# EAGLE design Raspberry_PI_Servo_Hat_v1 (EAGLE 7.5.0)
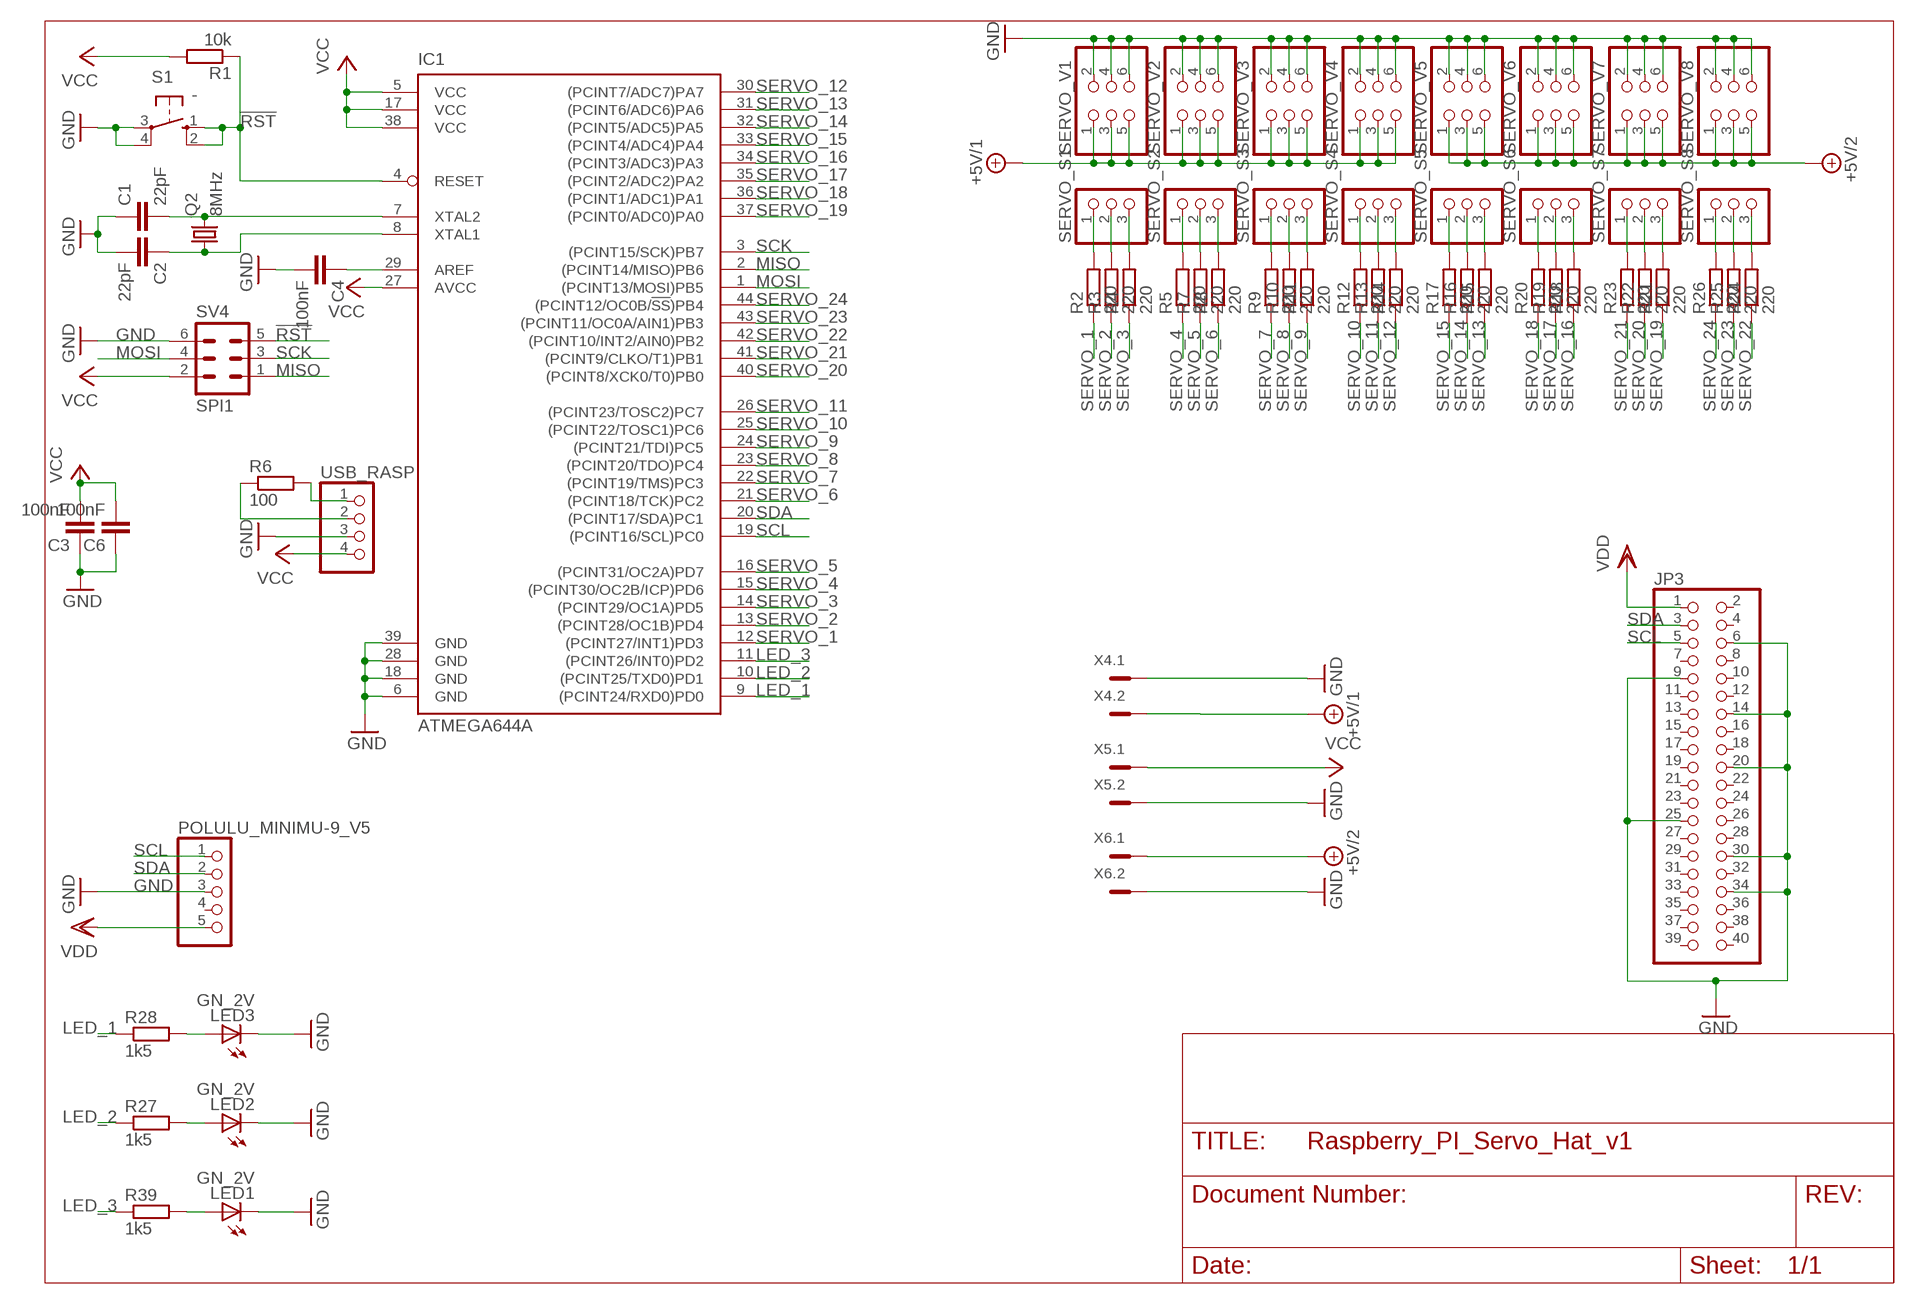
[diagram p0: schematic, sheet 1]

## Parts
C1  22pF  C-EUC0805  [C0805]
C2  22pF  C-EUC0805  [C0805]
C3  100nF  C-EUC0805  [C0805]
C4  100nF  C-EUC0805  [C0805]
C6  100nF  C-EUC0805  [C0805]
IC1  ATMEGA644A  [TQFP44]
JP3  PINHD-2X20  [2X20]
LED1  GN_2V  LED3MM  [LED3MM]
LED2  GN_2V  LED3MM  [LED3MM]
LED3  GN_2V  LED3MM  [LED3MM]
POLULU_MINIMU-9_V5  PINHD-1X5  [1X05]
Q2  8MHz  CRYSTALHC49U-V  [HC49U-V]
R1  10k  R-EU_R0805  [R0805]
R2  220  R-EU_R0805  [R0805]
R3  220  R-EU_R0805  [R0805]
R4  220  R-EU_R0805  [R0805]
R5  220  R-EU_R0805  [R0805]
R6  100  R-EU_R0805  [R0805]
R7  220  R-EU_R0805  [R0805]
R8  220  R-EU_R0805  [R0805]
R9  220  R-EU_R0805  [R0805]
R10  220  R-EU_R0805  [R0805]
R11  220  R-EU_R0805  [R0805]
R12  220  R-EU_R0805  [R0805]
R13  220  R-EU_R0805  [R0805]
R14  220  R-EU_R0805  [R0805]
R15  220  R-EU_R0805  [R0805]
R16  220  R-EU_R0805  [R0805]
R17  220  R-EU_R0805  [R0805]
R18  220  R-EU_R0805  [R0805]
R19  220  R-EU_R0805  [R0805]
R20  220  R-EU_R0805  [R0805]
R21  220  R-EU_R0805  [R0805]
R22  220  R-EU_R0805  [R0805]
R23  220  R-EU_R0805  [R0805]
R24  220  R-EU_R0805  [R0805]
R25  220  R-EU_R0805  [R0805]
R26  220  R-EU_R0805  [R0805]
R27  1k5  R-EU_R0805  [R0805]
R28  1k5  R-EU_R0805  [R0805]
R39  1k5  R-EU_R0805  [R0805]
S1  -  10-XX  [B3F-10XX]
SERVO_S1  PINHD-1X3  [1X03]
SERVO_S2  PINHD-1X3  [1X03]
SERVO_S3  PINHD-1X3  [1X03]
SERVO_S4  PINHD-1X3  [1X03]
SERVO_S5  PINHD-1X3  [1X03]
SERVO_S6  PINHD-1X3  [1X03]
SERVO_S7  PINHD-1X3  [1X03]
SERVO_S8  PINHD-1X3  [1X03]
SERVO_V1  PINHD-2X3  [2X03]
SERVO_V2  PINHD-2X3  [2X03]
SERVO_V3  PINHD-2X3  [2X03]
SERVO_V4  PINHD-2X3  [2X03]
SERVO_V5  PINHD-2X3  [2X03]
SERVO_V6  PINHD-2X3  [2X03]
SERVO_V7  PINHD-2X3  [2X03]
SERVO_V8  PINHD-2X3  [2X03]
SV4  SPI1  ML6  [ML6]
USB_RASP  PINHD-1X4  [1X04]
X4  MCV2  [MCV2]
X5  MCV2  [MCV2]
X6  MCV2  [MCV2]

## Nets
!RST: IC1.4(RESET) R1.1 S1.1(S) S1.2(S1) SV4.5
+5V/1: SERVO_V1.1 SERVO_V1.3 SERVO_V1.5 SERVO_V2.1 SERVO_V2.3 SERVO_V2.5 SERVO_V3.1 SERVO_V3.3 SERVO_V3.5 SERVO_V4.1 SERVO_V4.3 SERVO_V4.5 X4.2
+5V/2: SERVO_V5.1 SERVO_V5.3 SERVO_V5.5 SERVO_V6.1 SERVO_V6.3 SERVO_V6.5 SERVO_V7.1 SERVO_V7.3 SERVO_V7.5 SERVO_V8.1 SERVO_V8.3 SERVO_V8.5 X6.1
GND: C1.1 C2.2 C3.1 C4.2 C6.1 IC1.6(GND) IC1.18(GND) IC1.28(GND) IC1.39(GND) JP3.6 JP3.9 JP3.14 JP3.20 JP3.25 JP3.30 JP3.34 LED1.K(C) LED2.K(C) LED3.K(C) POLULU_MINIMU-9_V5.3 S1.3(P) S1.4(P1) SERVO_V1.2 SERVO_V1.4 SERVO_V1.6 SERVO_V2.2 SERVO_V2.4 SERVO_V2.6 SERVO_V3.2 SERVO_V3.4 SERVO_V3.6 SERVO_V4.2 SERVO_V4.4 SERVO_V4.6 SERVO_V5.2 SERVO_V5.4 SERVO_V5.6 SERVO_V6.2 SERVO_V6.4 SERVO_V6.6 SERVO_V7.2 SERVO_V7.4 SERVO_V7.6 SERVO_V8.2 SERVO_V8.4 SERVO_V8.6 SV4.6 USB_RASP.3 X4.1 X5.2 X6.2
LED_1: IC1.9((PCINT24/RXD0)PD0) R28.1
LED_2: IC1.10((PCINT25/TXD0)PD1) R27.1
LED_3: IC1.11((PCINT26/INT0)PD2) R39.1
MISO: IC1.2((PCINT14/MISO)PB6) SV4.1
MOSI: IC1.1((PCINT13/MOSI)PB5) SV4.4
N$1: C2.1 IC1.8(XTAL1) Q2.1
N$2: C1.2 IC1.7(XTAL2) Q2.2
N$3: R2.2 SERVO_S1.1
N$4: R3.2 SERVO_S1.2
N$5: R4.2 SERVO_S1.3
N$6: R5.2 SERVO_S2.1
N$7: R7.2 SERVO_S2.2
N$8: R8.2 SERVO_S2.3
N$9: R9.2 SERVO_S3.1
N$10: R10.2 SERVO_S3.2
N$11: R11.2 SERVO_S3.3
N$12: R12.2 SERVO_S4.1
N$13: R13.2 SERVO_S4.2
N$14: R14.2 SERVO_S4.3
N$15: R17.2 SERVO_S5.1
N$16: R16.2 SERVO_S5.2
N$17: R15.2 SERVO_S5.3
N$18: R20.2 SERVO_S6.1
N$19: R19.2 SERVO_S6.2
N$20: R18.2 SERVO_S6.3
N$21: R23.2 SERVO_S7.1
N$22: R22.2 SERVO_S7.2
N$23: R21.2 SERVO_S7.3
N$24: R26.2 SERVO_S8.1
N$25: R25.2 SERVO_S8.2
N$26: R24.2 SERVO_S8.3
N$27: LED2.A R27.2
N$28: LED3.A R28.2
N$29: R6.2 USB_RASP.1
N$32: C4.1 IC1.29(AREF)
N$85: LED1.A R39.2
N$86: R6.1 USB_RASP.2
SCK: IC1.3((PCINT15/SCK)PB7) SV4.3
SCL: IC1.19((PCINT16/SCL)PC0) JP3.5 POLULU_MINIMU-9_V5.1
SDA: IC1.20((PCINT17/SDA)PC1) JP3.3 POLULU_MINIMU-9_V5.2
SERVO_1: IC1.12((PCINT27/INT1)PD3) R2.1
SERVO_2: IC1.13((PCINT28/OC1B)PD4) R3.1
SERVO_3: IC1.14((PCINT29/OC1A)PD5) R4.1
SERVO_4: IC1.15((PCINT30/OC2B/ICP)PD6) R5.1
SERVO_5: IC1.16((PCINT31/OC2A)PD7) R7.1
SERVO_6: IC1.21((PCINT18/TCK)PC2) R8.1
SERVO_7: IC1.22((PCINT19/TMS)PC3) R9.1
SERVO_8: IC1.23((PCINT20/TDO)PC4) R10.1
SERVO_9: IC1.24((PCINT21/TDI)PC5) R11.1
SERVO_10: IC1.25((PCINT22/TOSC1)PC6) R12.1
SERVO_11: IC1.26((PCINT23/TOSC2)PC7) R13.1
SERVO_12: IC1.30((PCINT7/ADC7)PA7) R14.1
SERVO_13: IC1.31((PCINT6/ADC6)PA6) R15.1
SERVO_14: IC1.32((PCINT5/ADC5)PA5) R16.1
SERVO_15: IC1.33((PCINT4/ADC4)PA4) R17.1
SERVO_16: IC1.34((PCINT3/ADC3)PA3) R18.1
SERVO_17: IC1.35((PCINT2/ADC2)PA2) R19.1
SERVO_18: IC1.36((PCINT1/ADC1)PA1) R20.1
SERVO_19: IC1.37((PCINT0/ADC0)PA0) R21.1
SERVO_20: IC1.40((PCINT8/XCK0/T0)PB0) R22.1
SERVO_21: IC1.41((PCINT9/CLKO/T1)PB1) R23.1
SERVO_22: IC1.42((PCINT10/INT2/AIN0)PB2) R24.1
SERVO_23: IC1.43((PCINT11/OC0A/AIN1)PB3) R25.1
SERVO_24: IC1.44((PCINT12/OC0B/!SS!)PB4) R26.1
VCC: C3.2 C6.2 IC1.5(VCC) IC1.17(VCC) IC1.27(AVCC) IC1.38(VCC) R1.2 SV4.2 USB_RASP.4 X5.1
VDD: JP3.1 POLULU_MINIMU-9_V5.5
Unconnected: JP3.2 JP3.4 JP3.7 JP3.8 JP3.10 JP3.11 JP3.12 JP3.13 JP3.15 JP3.16 JP3.17 JP3.18 JP3.19 JP3.21 JP3.22 JP3.23 JP3.24 JP3.26 JP3.27 JP3.28 JP3.29 JP3.31 JP3.32 JP3.33 JP3.35 JP3.36 JP3.37 JP3.38 JP3.39 JP3.40 POLULU_MINIMU-9_V5.4

## Library data of the parts
C1 C2 = rcl:C-EU: CAPACITOR, European symbol
C3 C4 C6 = resistor:C-EU: CAPACITOR, European symbol
IC1 = atmel:ATMEGA644: 8-bit Microcontroller with 64K Bytes In-System Programmable Flash Source: http://www.atmel.com/dyn/resources/prod_documents/doc2593.pdf; MPN: ATMEGA644PV-10AU; OC_FARNELL: 1455123; OC_NEWARK: 58M3748
JP3 = pinhead:PINHD-2X20: PIN HEADER
LED1-LED3 = led:LED: LED OSRAM: - CHIPLED LG R971, LG N971, LY N971, LG Q971, LY Q971, LO R971, LY R971 LH N974, LH R974 LS Q976, LO Q976, LY Q976 LO Q996 - Hyper CHIPLED LW Q18S LB Q993, LB Q99A, LB R99A - SideLED LS A670, LO A670, LY A670, LG A670, LP A670 LB A673, LV A673, LT A673, LW A673 LH A674 LY A675 LS A676, LA A676, LO A676, LY A676, LW A676 LS A679, LY A679, LG A679 - Hyper Micro SIDELED® LS Y876, LA Y876, LO Y876, LY Y876 LT Y87S - SmartLED LW L88C, LW L88S LB L89C, LB L89S, LG L890 LS L89K, LO L89K, LY L89K LS L896, LA L896, LO L896, LY L896 - TOPLED LS T670, LO T670, LY T670, LG T670, LP T670 LSG T670, LSP T670, LSY T670, LOP T670, LYG T670 LG T671, LOG T671, LSG T671 LB T673, LV T673, LT T673, LW T673 LH T674 LS T676, LA T676, LO T676, LY T676, LB T676, LH T676, LSB T676, LW T676 LB T67C, LV T67C, LT T67C, LS T67K, LO T67K, LY T67K, LW E67C LS E67B, LA E67B, LO E67B, LY E67B, LB E67C, LV E67C, LT E67C LW T67C LS T679, LY T679, LG T679 LS T770, LO T770, LY T770, LG T770, LP T770 LB T773, LV T773, LT T773, LW T773 LH T774 LS E675, LA E675, LY E675, LS T675 LS T776, LA T776, LO T776, LY T776, LB T776 LHGB T686 LT T68C, LB T68C - Hyper Mini TOPLED® LB M676 - Mini TOPLED Santana® LG M470 LS M47K, LO M47K, LY M47K Source: http://www.osram.convergy.de LUXEON: - LUMILED® LXK2-PW12-R00, LXK2-PW12-S00, LXK2-PW14-U00, LXK2-PW14-V00 LXK2-PM12-R00, LXK2-PM12-S00, LXK2-PM14-U00 LXK2-PE12-Q00, LXK2-PE12-R00, LXK2-PE12-S00, LXK2-PE14-T00, LXK2-PE14-U00 LXK2-PB12-K00, LXK2-PB12-L00, LXK2-PB12-M00, LXK2-PB14-N00, LXK2-PB14-P00, LXK2-PB14-Q00 LXK2-PR12-L00, LXK2-PR12-M00, LXK2-PR14-Q00, LXK2-PR14-R00 LXK2-PD12-Q00, LXK2-PD12-R00, LXK2-PD12-S00 LXK2-PH12-R00, LXK2-PH12-S00 LXK2-PL12-P00, LXK2-PL12-Q00, LXK2-PL12-R00 Source: www.luxeon.com KINGBRIGHT: KA-3528ASYC Source: www.kingbright.com
POLULU_MINIMU-9_V5 = pinhead:PINHD-1X5: PIN HEADER
Q2 = crystal:CRYSTAL: CRYSTAL; OC_FARNELL: 1666969; OC_NEWARK: unknown
R1-R5 R7-R26 = resistor:R-EU_: RESISTOR, European symbol
R6 R27 R28 R39 = rcl:R-EU_: RESISTOR, European symbol
S1 = switch-omron:10-XX: OMRON SWITCH; MPN: B3F-1000; OC_FARNELL: 176432; OC_NEWARK: 36M3542
SERVO_S1-SERVO_S8 = pinhead_NEW:PINHD-1X3: PIN HEADER
SERVO_V1-SERVO_V8 = pinhead:PINHD-2X3: PIN HEADER
SV4 = con-harting-ml:ML6: HARTING; OC_FARNELL: unknown; OC_NEWARK: unknown
USB_RASP = pinhead:PINHD-1X4: PIN HEADER
X4-X6 = con-phoenix_3.81_mcv:MCV2: Mini-Combicon 3.81mm vertikal 2polig (ohne Gegenstecker)

## Board
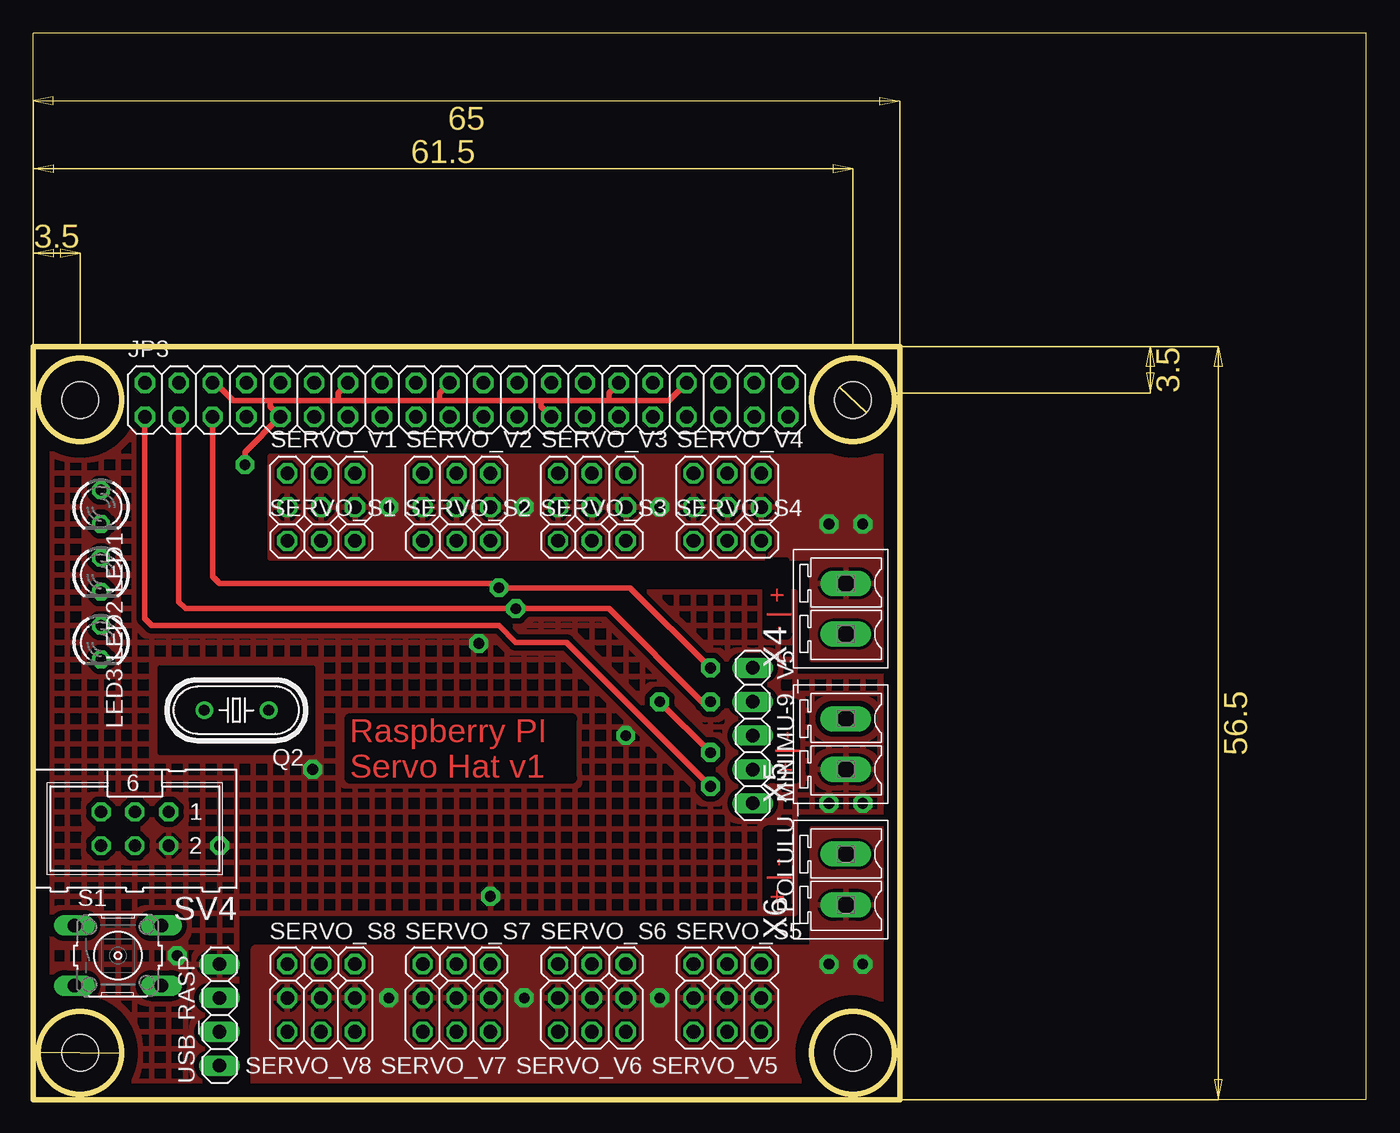
[diagram p1: board, top side]
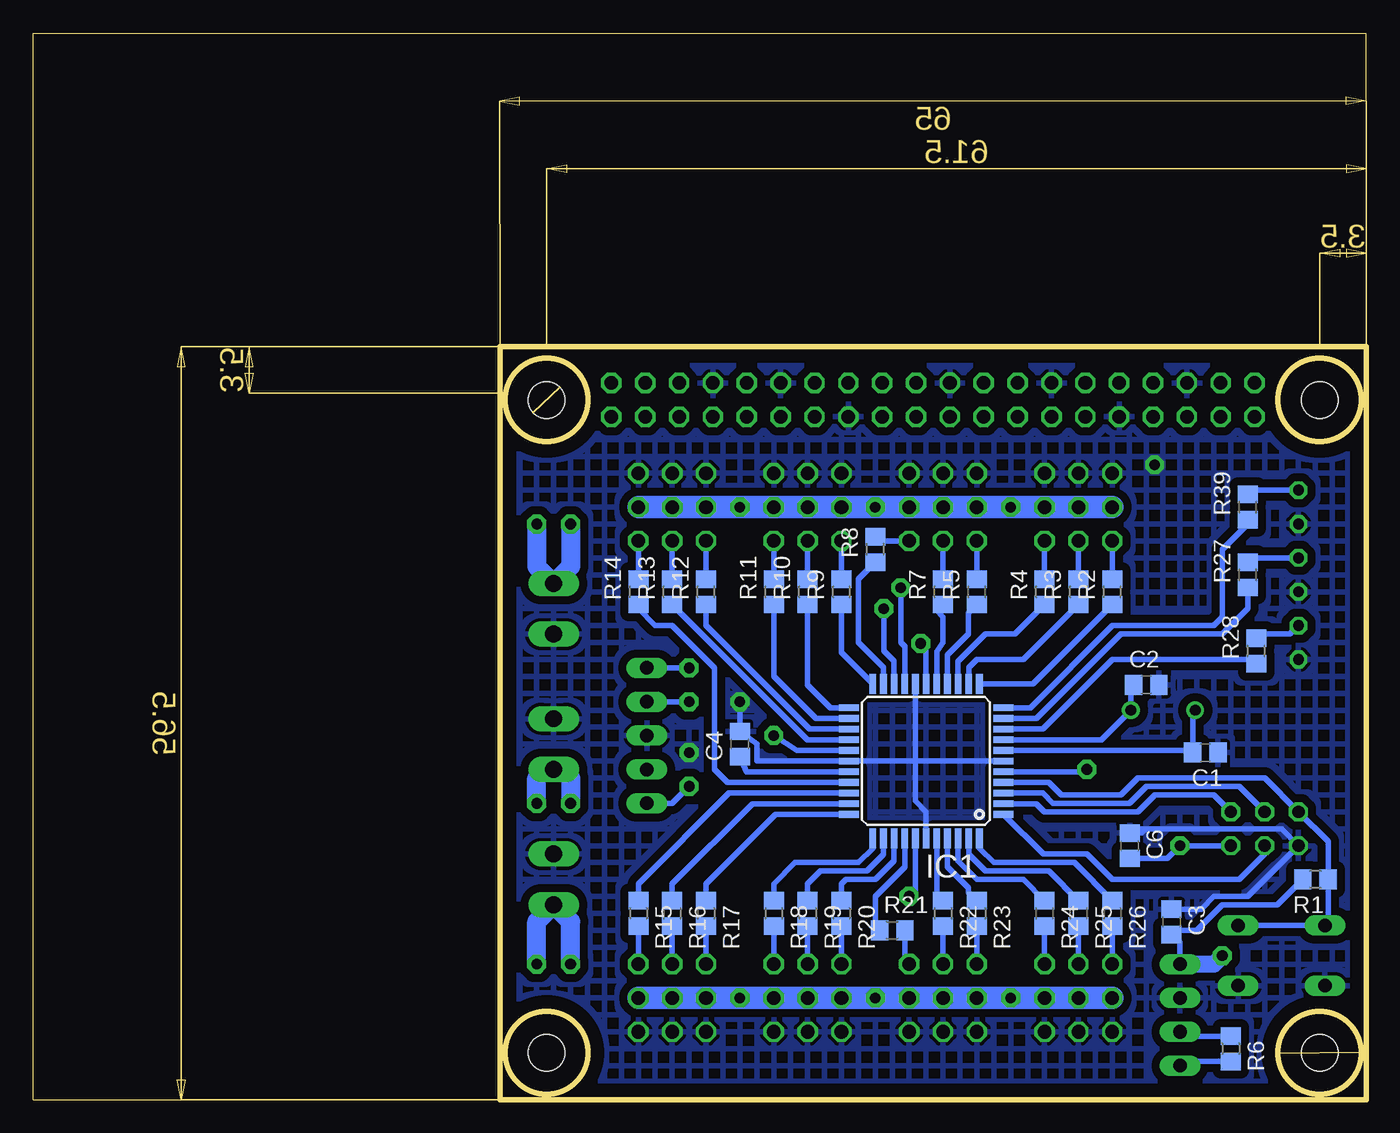
[diagram p2: board, bottom side, seen from below]

Size 100 x 80 mm. Coordinates in mm from the lower left corner, seen from the top.
Outline: 0,0 65,0 65,56.5 0,56.5 0,0
Outline: 0,0 0,80 100,80 100,0 0,0
Outline: circle at 3.5,3.5 radius 3.1
Outline: circle at 3.5,52.5 radius 3.1
Outline: circle at 61.5,3.5 radius 3.1
Outline: circle at 61.5,52.5 radius 3.1
Copper layers (1*16): Top 0.035mm / dielectric 1.5mm / Bottom 0.035mm
Design rules "default": minimum track width 10mil, minimum drill 24mil, track to track 8mil, track to pad 8mil, pad to pad 8mil, via to via 8mil, smd to smd 8mil, copper to edge 40mil, drill to drill 8mil, minimum pad ring 10mil, minimum via ring 8mil, stop-mask expansion 4mil, vias tented up to drill 0mil, thermal gap 10mil
Holes 2.75 mm at 3.5,52.5 61.5,52.5 3.5,3.5 61.5,3.5

### Footprints (pad centres in the part's own frame; a part is rotated, then mirrored left to right if it is on the bottom)
C0805 = smd 1.3 x 1.5: 1 -0.95,0; 2 0.95,0
TQFP44 = smd 1.5 x 0.5: 1 -5.8,4; 2 -5.8,3.2; 3 -5.8,2.4; 4 -5.8,1.6; 5 -5.8,0.8; 6 -5.8,0; 7 -5.8,-0.8; 8 -5.8,-1.6; 9 -5.8,-2.4; 10 -5.8,-3.2; 11 -5.8,-4; 23 5.8,-4; 24 5.8,-3.2; 25 5.8,-2.4; 26 5.8,-1.6; 27 5.8,-0.8; 28 5.8,0; 29 5.8,0.8; 30 5.8,1.6; 31 5.8,2.4; 32 5.8,3.2; 33 5.8,4 | smd 0.5 x 1.5: 12 -4,-5.8; 13 -3.2,-5.8; 14 -2.4,-5.8; 15 -1.6,-5.8; 16 -0.8,-5.8; 17 0,-5.8; 18 0.8,-5.8; 19 1.6,-5.8; 20 2.4,-5.8; 21 3.2,-5.8; 22 4,-5.8; 34 4,5.8; 35 3.2,5.8; 36 2.4,5.8; 37 1.6,5.8; 38 0.8,5.8; 39 0,5.8; 40 -0.8,5.8; 41 -1.6,5.8; 42 -2.4,5.8; 43 -3.2,5.8; 44 -4,5.8
2X20 = drill 1.016 octagon: 1 -24.13,-1.27; 2 -24.13,1.27; 3 -21.59,-1.27; 4 -21.59,1.27; 5 -19.05,-1.27; 6 -19.05,1.27; 7 -16.51,-1.27; 8 -16.51,1.27; 9 -13.97,-1.27; 10 -13.97,1.27; 11 -11.43,-1.27; 12 -11.43,1.27; 13 -8.89,-1.27; 14 -8.89,1.27; 15 -6.35,-1.27; 16 -6.35,1.27; 17 -3.81,-1.27; 18 -3.81,1.27; 19 -1.27,-1.27; 20 -1.27,1.27; 21 1.27,-1.27; 22 1.27,1.27; 23 3.81,-1.27; 24 3.81,1.27; 25 6.35,-1.27; 26 6.35,1.27; 27 8.89,-1.27; 28 8.89,1.27; 29 11.43,-1.27; 30 11.43,1.27; 31 13.97,-1.27; 32 13.97,1.27; 33 16.51,-1.27; 34 16.51,1.27; 35 19.05,-1.27; 36 19.05,1.27; 37 21.59,-1.27; 38 21.59,1.27; 39 24.13,-1.27; 40 24.13,1.27
LED3MM = drill 0.813 octagon: A -1.27,0; K 1.27,0
1X05 = drill 1.016 long: 1 -5.08,0; 2 -2.54,0; 3 0,0; 4 2.54,0; 5 5.08,0
HC49U-V = drill 0.813: 1 -2.413,0; 2 2.413,0
R0805 = smd 1.3 x 1.5: 1 -0.95,0; 2 0.95,0
B3F-10XX = drill 1.016 long: 1 -3.251,2.261; 2 3.251,2.261; 3 -3.251,-2.261; 4 3.251,-2.261
1X03 = drill 1.016 octagon: 1 -2.54,0; 2 0,0; 3 2.54,0
2X03 = drill 1.016 octagon: 1 -2.54,-1.27; 2 -2.54,1.27; 3 0,-1.27; 4 0,1.27; 5 2.54,-1.27; 6 2.54,1.27
ML6 = drill 0.914 octagon: 1 -2.54,-1.27; 2 -2.54,1.27; 3 0,-1.27; 4 0,1.27; 5 2.54,-1.27; 6 2.54,1.27
1X04 = drill 1.016 long: 1 -3.81,0; 2 -1.27,0; 3 1.27,0; 4 3.81,0
MCV2 = drill 1.27 pad 1.905 long: 1 -1.905,0; 2 1.905,0

### Placement (x,y rotation side)
C1  12.06,26.04 180 bottom
C2  16.51,31.11 0 bottom
C3  14.61,13.34 270 bottom
C4  46.99,26.67 90 bottom
C6  17.75,19.04 270 bottom
IC1  33.02,25.4 180 bottom
JP3  32.5,52.5 0 top
LED1  5.08,44.45 270 top
LED2  5.08,39.37 270 top
LED3  5.08,34.29 270 top
POLULU_MINIMU-9_V5  53.98,27.3 270 top
Q2  15.24,29.21 180 top
R1  3.81,16.51 180 bottom
R2  19.05,38.1 90 bottom
R3  21.59,38.1 90 bottom
R4  24.13,38.1 90 bottom
R5  29.21,38.1 90 bottom
R6  10.16,3.81 270 bottom
R7  31.75,38.1 90 bottom
R8  36.83,41.27 90 bottom
R9  39.37,38.1 90 bottom
R10  41.91,38.1 90 bottom
R11  44.45,38.1 90 bottom
R12  49.53,38.1 90 bottom
R13  52.07,38.1 90 bottom
R14  54.61,38.1 90 bottom
R15  54.61,13.97 270 bottom
R16  52.07,13.97 270 bottom
R17  49.53,13.97 270 bottom
R18  44.45,13.97 270 bottom
R19  41.91,13.97 270 bottom
R20  39.37,13.97 270 bottom
R21  35.56,12.7 0 bottom
R22  31.75,13.97 270 bottom
R23  29.21,13.97 270 bottom
R24  24.13,13.97 270 bottom
R25  21.59,13.97 270 bottom
R26  19.05,13.97 270 bottom
R27  8.89,39.37 90 bottom
R28  8.26,33.66 90 bottom
R39  8.89,44.45 90 bottom
S1  6.35,10.79 0 top
SERVO_S1  21.59,41.91 0 top
SERVO_S2  31.75,41.91 0 top
SERVO_S3  41.91,41.91 0 top
SERVO_S4  52.07,41.91 0 top
SERVO_S5  52.07,10.16 0 top
SERVO_S6  41.91,10.16 0 top
SERVO_S7  31.75,10.16 0 top
SERVO_S8  21.59,10.16 0 top
SERVO_V1  21.59,45.72 0 top
SERVO_V2  31.75,45.72 0 top
SERVO_V3  41.91,45.72 0 top
SERVO_V4  52.07,45.72 0 top
SERVO_V5  52.07,6.35 180 top
SERVO_V6  41.91,6.35 180 top
SERVO_V7  31.75,6.35 180 top
SERVO_V8  21.59,6.35 180 top
SV4  7.62,20.32 180 top
USB_RASP  13.97,6.35 90 top
X4  60.96,36.83 90 top
X5  60.96,26.67 90 top
X6  60.96,16.51 90 top

### Tracks (layer width: path | path; a pad name or v marks a point on that pad's centre or on a via)
!RST
  Bottom 0.406: S1.2 S1.1 2.86,12.66 R1.1 2.86,19.37 SV4.5 7.62,24.13 17.14,24.13 18.41,22.86 22.86,22.86 23.8,23.8 IC1.4
+5V/1  (via drill 0.8 pad 1.42)
  Bottom 1.422: v59.69,43.18 59.69,40.01 X4.2 62.23,40.01 v62.23,43.18
  Bottom 1.676: SERVO_V1.1 SERVO_V1.3 SERVO_V1.5 v26.67,44.45 SERVO_V2.1 SERVO_V2.3 SERVO_V2.5 v36.83,44.45 SERVO_V3.1 SERVO_V3.3 SERVO_V3.5 v46.99,44.45 SERVO_V4.1 SERVO_V4.3 SERVO_V4.5
  pour Top: 17.78,48.26 64.77,48.26 64.77,33.02 58.42,33.02 58.42,40.64 17.78,40.64
+5V/2  (via drill 0.8 pad 1.42)
  Bottom 1.422: v59.69,10.16 59.69,13.34 X6.1 62.23,13.34 v62.23,10.16
  Bottom 1.676: SERVO_V8.5 SERVO_V8.3 SERVO_V8.1 v26.67,7.62 SERVO_V7.5 SERVO_V7.3 SERVO_V7.1 v36.83,7.62 SERVO_V6.5 SERVO_V6.3 SERVO_V6.1 v46.99,7.62 SERVO_V5.5 SERVO_V5.3 SERVO_V5.1
  pour Top: 58.42,20.32 58.42,11.43 16.76,11.43 arc90 16.51,11.18 16.51,0 64.52,0 arc90 64.77,0.25 64.77,20.32
GND  (via drill 0.8 pad 1.42)
  Top 0.406: v46.99,29.84 v50.8,26.04 | JP3.34 47.69,52.45 43.18,52.45 | 43.18,52.45 38.1,52.45 | 38.1,52.45 30.48,52.45 | 30.48,52.45 22.86,52.45 | 22.86,52.45 17.78,52.45 | 17.78,52.45 14.99,52.45 13.67,53.77 JP3.6 | JP3.30 43.18,53.02 43.18,52.45 | JP3.25 38.1,51.98 38.1,52.45 | JP3.20 30.48,53.02 30.48,52.45 | JP3.14 22.86,53.02 22.86,52.45 | 17.78,52.45 17.78,51.98 JP3.9 15.88,48.58 v15.88,47.62
  Bottom 0.406: IC1.6 33.82,25.4 | IC1.18 33.82,25.4 | 33.82,25.4 33.82,22.39 33.02,21.59 IC1.39 | 33.82,25.4 IC1.28 45.72,25.4 45.72,26.67 C4.2 v46.99,29.84 | 17.78,20.32 16.51,20.32 | 16.51,20.32 6.35,20.32 SV4.6 8.89,15.24 11.43,15.24 12.38,14.29 C3.1 | C6.1 16.84,19.99 16.51,20.32
  pour Bottom (isolate 0.61, hatched): 0,56.52 64.77,56.52 64.77,0 0,0
LED_1
  Bottom 0.406: IC1.9 24.27,27.8 19.05,33.02 8.57,33.02 R28.1
LED_2
  Bottom 0.406: IC1.10 24.74,28.6 18.41,34.92 10.79,34.92 8.89,36.83 R27.1
LED_3
  Bottom 0.406: IC1.11 25.21,29.4 19.05,35.56 11.43,35.56 10.79,36.2 10.79,41.27 8.89,43.18 R39.1
MISO
  Bottom 0.406: SV4.1 11.43,22.86 15.88,22.86 17.14,21.59 24.13,21.59 24.74,22.2 IC1.2
MOSI
  Bottom 0.406: IC1.1 24.23,18.41 20.95,18.41 19.05,16.51 9.53,16.51 7.62,18.41 SV4.4
N$1
  Bottom 0.406: IC1.8 19.86,27 Q2.1 17.65,30.92 C2.1
N$2
  Bottom 0.406: Q2.2 13.02,29.02 C1.2 13.18,26.2 IC1.7
N$3
  Bottom 0.406: R2.2 SERVO_S1.1
N$4
  Bottom 0.406: R3.2 SERVO_S1.2
N$5
  Bottom 0.406: R4.2 SERVO_S1.3
N$6
  Bottom 0.406: R5.2 SERVO_S2.1
N$7
  Bottom 0.406: R7.2 SERVO_S2.2
N$8
  Bottom 0.406: SERVO_S2.3 36.83,41.91 R8.2
N$9
  Bottom 0.406: R9.2 SERVO_S3.1
N$10
  Bottom 0.406: SERVO_S3.2 R10.2
N$11
  Bottom 0.406: R11.2 SERVO_S3.3
N$12
  Bottom 0.406: SERVO_S4.1 R12.2
N$13
  Bottom 0.406: R13.2 SERVO_S4.2
N$14
  Bottom 0.406: R14.2 SERVO_S4.3
N$15
  Bottom 0.406: SERVO_S5.1 R17.2
N$16
  Bottom 0.406: SERVO_S5.2 R16.2
N$17
  Bottom 0.406: SERVO_S5.3 R15.2
N$18
  Bottom 0.406: SERVO_S6.1 R20.2
N$19
  Bottom 0.406: SERVO_S6.2 R19.2
N$20
  Bottom 0.406: SERVO_S6.3 R18.2
N$21
  Bottom 0.406: R23.2 SERVO_S7.1
N$22
  Bottom 0.406: SERVO_S7.2 R22.2
N$23
  Bottom 0.406: R21.2 34.61,10.48 SERVO_S7.3
N$24
  Bottom 0.406: SERVO_S8.1 R26.2
N$25
  Bottom 0.406: R25.2 SERVO_S8.2
N$26
  Bottom 0.406: SERVO_S8.3 R24.2
N$27
  Bottom 0.406: R27.2 8.57,40.64 LED2.A
N$28
  Bottom 0.406: R28.2 7.93,34.92 5.71,34.92 LED3.A
N$29
  Bottom 0.406: USB_RASP.1 13.65,2.86 R6.2
N$30
  cutout Top: 20.95,26.04 20.95,32.38 9.53,32.38 9.53,26.04
N$32
  Bottom 0.406: C4.1 46.51,24.6 IC1.29
N$85
  Bottom 0.406: R39.2 8.57,45.72 LED1.A
N$86
  Bottom 0.406: USB_RASP.2 13.65,4.76 R6.1
SCK
  Bottom 0.406: SV4.3 9.53,23.5 16.51,23.5 17.78,22.23 23.5,22.23 24.27,23 IC1.3
SCL  (via drill 0.8 pad 1.42)
  Top 0.406: JP3.5 13.45,39.26 13.97,38.73 34.59,38.73 v34.92,38.4 44.78,38.4 v50.8,32.38
  Bottom 0.406: IC1.19 34.62,33.98 34.92,34.29 v34.92,38.4 | v50.8,32.38 POLULU_MINIMU-9_V5.1
SDA  (via drill 0.8 pad 1.42)
  Top 0.406: v50.8,29.84 50.16,29.84 43.18,36.83 v36.2,36.83 11.43,36.83 10.91,37.35 JP3.3
  Bottom 0.406: v50.8,29.84 POLULU_MINIMU-9_V5.2 | v36.2,36.83 36.2,33.66 35.43,32.89 35.43,31.21 IC1.20
SERVO_1
  Bottom 0.406: R2.1 25,31.2 IC1.12
SERVO_2
  Bottom 0.406: R3.1 25.72,33.02 29.21,33.02 29.82,32.41 IC1.13
SERVO_3
  Bottom 0.406: R4.1 26.36,34.92 28.57,34.92 30.62,32.88 IC1.14
SERVO_4
  Bottom 0.406: R5.1 29.84,36.52 29.84,34.92 31.42,33.35 IC1.15
SERVO_5
  Bottom 0.406: R7.1 32.22,36.68 31.75,36.21 31.75,34.29 32.22,33.62 IC1.16
SERVO_6
  Bottom 0.406: IC1.21 36.22,32.41 38.1,34.29 38.1,39.05 R8.1
SERVO_7
  Bottom 0.406: R9.1 39.37,33.55 IC1.22
SERVO_8
  Bottom 0.406: R10.1 41.91,31.11 40.2,29.4 IC1.23
SERVO_9
  Bottom 0.406: R11.1 44.45,31.75 41.3,28.6 IC1.24
SERVO_10
  Bottom 0.406: IC1.25 41.77,27.8 49.53,35.56 R12.1
SERVO_11
  Bottom 0.406: R13.1 41.92,27 IC1.26
SERVO_12
  Bottom 0.406: IC1.30 47.93,23.8 48.9,24.77 48.9,32.38 52.07,35.56 53.34,35.56 54.61,36.83 R14.1
SERVO_13
  Bottom 0.406: IC1.31 47.8,23 54.61,16.19 R15.1
SERVO_14
  Bottom 0.406: IC1.32 46.06,22.2 52.07,16.19 R16.1
SERVO_15
  Bottom 0.406: IC1.33 44.32,21.4 49.53,16.19 R17.1
SERVO_16
  Bottom 0.406: IC1.34 37.02,18.86 38.1,17.78 42.86,17.78 44.45,16.19 R18.1
SERVO_17
  Bottom 0.406: IC1.35 36.22,18.39 37.47,17.14 40.95,17.14 41.91,16.19 R19.1
SERVO_18
  Bottom 0.406: IC1.36 35.42,17.92 36.83,16.51 39.05,16.51 39.37,16.19 R20.1
SERVO_19
  Bottom 0.406: R21.1 36.83,13.02 36.83,15.24 34.62,17.45 IC1.37
SERVO_20
  Bottom 0.406: R22.1 32.22,15.39 IC1.40
SERVO_21
  Bottom 0.406: R23.1 29.84,15.55 29.84,15.88 31.42,17.45 IC1.41
SERVO_22
  Bottom 0.406: R24.1 25.72,16.51 29.21,16.51 30.62,17.92 IC1.42
SERVO_23
  Bottom 0.406: R25.1 23.82,17.14 28.57,17.14 29.82,18.39 IC1.43
SERVO_24
  Bottom 0.406: R26.1 21.91,17.78 27.94,17.78 29.02,18.86 IC1.44
VCC  (via drill 0.8 pad 1.42)
  Bottom 0.406: R1.2 6.67,14.61 10.79,14.61 12.7,12.7 14.29,12.7 | v44.45,27.3 42.71,26.2 IC1.27 | v34.29,15.24 33.82,15.71 IC1.38 | v20.95,24.77 21.12,24.6 IC1.5 | USB_RASP.4 13.97,11.75 14.29,12.7 | 14.29,12.7 C3.2 | IC1.17 33.02,33.83 v33.42,34.23 | SV4.2 v13.97,19.05 14.93,18.09 C6.2
  Bottom 1.27: v10.79,10.79 11.43,10.16 USB_RASP.4
  Bottom 1.422: v59.69,22.23 59.69,24.13 60.33,24.77 X5.1 61.59,24.77 62.23,24.13 v62.23,22.23
  pour Top (isolate 0.406, hatched): 64.77,31.75 57.15,31.75 57.15,38.1 15.24,38.1 15.24,50.8 64.77,50.8 64.77,56.52 0,56.52 0,0 15.24,0 15.24,13.97 57.15,13.97 57.15,21.59 64.77,21.59
VDD  (via drill 0.8 pad 1.42)
  Top 0.406: JP3.1 8.37,36.08 8.89,35.56 34.92,35.56 36.2,34.29 40.01,34.29 v50.8,23.5
  Bottom 0.406: v50.8,23.5 52.07,22.23 POLULU_MINIMU-9_V5.5

### Text on the board
Top: - | + | Raspberry PI / Servo Hat v1 | + | - | + | -